# Altium project CPU_board.PrjPCB
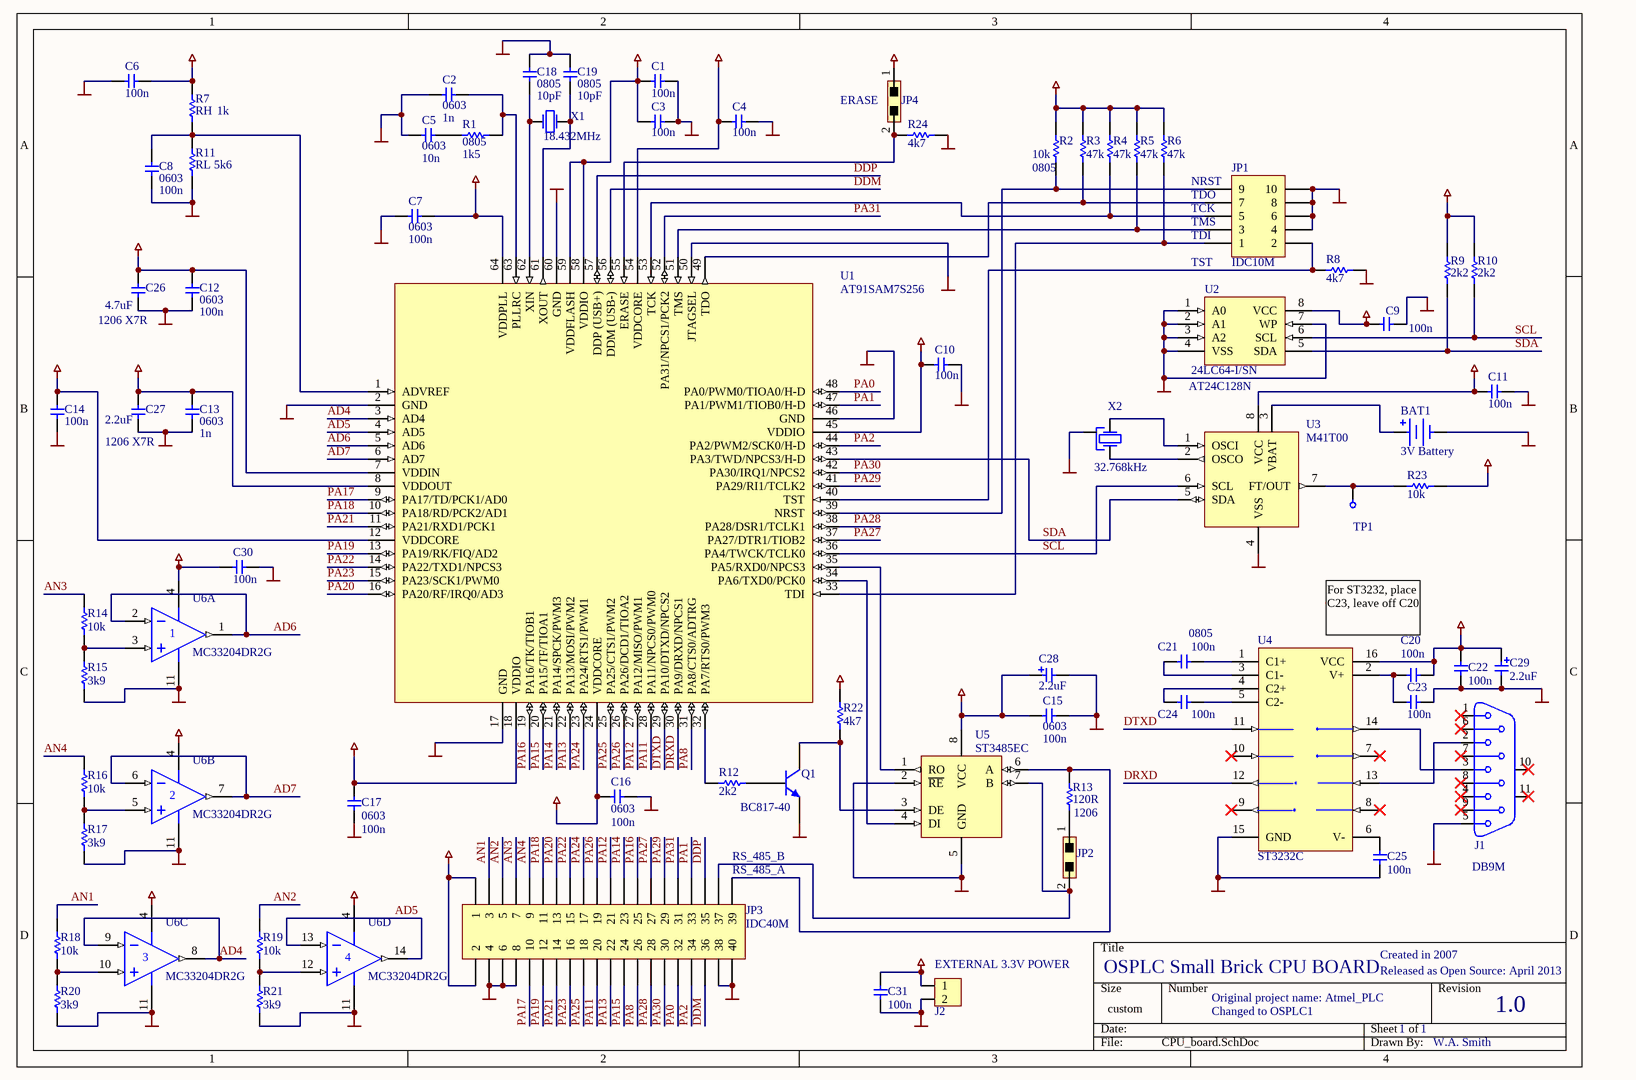
[diagram p0: CPU_board.SchDoc]
1 sheet, 72 parts. Net scope: global (net labels, ports and power ports of the same name join across sheets).
Board file: CPU_Board.PcbDoc

## Sheet CPU_board.SchDoc
size 294 x 198 mm

### Parts
BAT1  3V Battery  [BATTERY_22MM]
C1  value 100n  [0603]  (hidden comment: 0603)
C2  0603  value 1n  [0603]
C3  value 100n  [0603]  (hidden comment: 0603)
C4  value 100n  [0603]  (hidden comment: 0603)
C5  0603  value 10n  [0603]
C6  value 100n  [0603]  (hidden comment: 0603)
C7  0603  value 100n  [0603]
C8  0603  value 100n  [0603]
C9  value 100n  [0603]  (hidden comment: 0603)
C10  value 100n  [0603]  (hidden comment: 0603)
C11  value 100n  [0603]  (hidden comment: 0603)
C12  0603  value 100n  [0603]
C13  0603  value 1n  [0603]
C14  value 100n  [0603]  (hidden comment: 0603)
C15  0603  value 100n  [0603]
C16  0603  value 100n  [0603]
C17  0603  value 100n  [0603]
C18  0805  value 10pF  [0805]
C19  0805  value 10pF  [0805]
C20  value 100n  [0805]  (hidden comment: 0805)
C21  0805  value 100n  [0805]
C22  value 100n  [0805]  (hidden comment: 0805)
C23  value 100n  [0805]  (hidden comment: 0805)
C24  value 100n  [0805]  (hidden comment: 0805)
C25  value 100n  [0805]  (hidden comment: 0805)
C26  1206 X7R  value 4.7uF  [1206]
C27  1206 X7R  value 2.2uF  [1206]
C28  value 2.2uF  [CAP_TANT_A]  (hidden comment: Tant_A)
C29  value 2.2uF  [CAP_TANT_A]  (hidden comment: Tant_A)
C30  value 100n  [0603]  (hidden comment: 0603)
C31  value 100n  [0805]  (hidden comment: 0805)
J1  DB9M  [DB9M]
J2  Mini Screw Terminal  [MINI_TERMINAL_2]  (value not drawn)
JP1  IDC10M  [IDC_10M_BOX]
JP2  JUMPER2  [JUMPER2_254]  (value not drawn)
JP3  IDC40M  [IDC_40M_BOX]
JP4  JUMPER2  [JUMPER2_254]  (value not drawn)
Q1  BC817-40  [SO-G3/Y1]
R1  0805  value 1k5  [0805]
R2  0805  value 10k  [0805]
R3  value 47k  [0805]  (hidden comment: 0805)
R4  value 47k  [0805]  (hidden comment: 0805)
R5  value 47k  [0805]  (hidden comment: 0805)
R6  value 47k  [0805]  (hidden comment: 0805)
R7  value RH  [0805]  (hidden comment: 0805)
R8  value 4k7  [0805]  (hidden comment: 0805)
R9  value 2k2  [0805]  (hidden comment: 0805)
R10  value 2k2  [0805]  (hidden comment: 0805)
R11  value RL  [0805]  (hidden comment: 0805)
R12  value 2k2  [0805]  (hidden comment: 0805)
R13  1206  value 120R  [1206]
R14  value 10k  [0805]  (hidden comment: 0805)
R15  value 3k9  [0805]  (hidden comment: 0805)
R16  value 10k  [0805]  (hidden comment: 0805)
R17  value 3k9  [0805]  (hidden comment: 0805)
R18  value 10k  [0805]  (hidden comment: 0805)
R19  value 10k  [0805]  (hidden comment: 0805)
R20  value 3k9  [0805]  (hidden comment: 0805)
R21  value 3k9  [0805]  (hidden comment: 0805)
R22  value 4k7  [0805]  (hidden comment: 0805)
R23  value 10k  [0805]  (hidden comment: 0805)
R24  value 4k7  [0805]  (hidden comment: 0805)
TP1  TEST POINT  [TEST_POINT]  (value not drawn)
U1  AT91SAM7S256  [LQFP64-10-05]
U2  24LC64-I/SN  value AT24C128N  [SO-G8/Z7.4]
U3  M41T00  [SO-G8/X.6]
U4  ST3232C  [SO-G16/G6.9]
U5  ST3485EC  [SO-G8/Z7.4]
U6  MC33204DR2G  [SO-G14/Y2.2]  (parts A,B,C,D of 4)
X1  18.432MHz  [CRYSTAL_SMT]
X2  32.768kHz  [XTAL_TF]

### Nets
GND: BAT1.2(NEG) C1.2 C2.1 C3.2 C4.2 C5.1 C6.1 C7.1 C8.1 C9.2 C10.1 C11.2 C12.1 C13.1 C14.1 C15.2 C16.2 C17.1 C18.2 C19.2 C22.2 C23.1 C25.1 C26.1 C27.1 C28.2 C29.2 C30.2 C31.1 J1.5 J2.2 JP1.4 JP1.6 JP1.8 JP1.10 JP3.4 JP3.6 JP3.8 JP3.38 JP3.40 Q1.2(E) R8.1 R11.1 R15.1 R17.1 R20.1 R21.1 R24.2 U1.2(GND) U1.17(GND) U1.46(GND) U1.50(JTAGSEL) U1.60(GND) U2.1(A0) U2.2(A1) U2.3(A2) U2.4(VSS) U2.7(WP) U3.4(VSS) U4.15(GND) U5.2(~{RE}) U5.5(GND) U6.11(V-) X2.3(X)
VCC1v8: C4.1 C7.2 C13.2 C14.2 C16.1 C27.2 U1.8(VDDOUT) U1.12(VDDCORE) U1.24(VDDCORE) U1.54(VDDCORE) U1.64(VDDPLL)
VCC3v3: C1.1 C3.1 C6.2 C9.1 C10.2 C11.1 C12.2 C15.1 C17.2 C20.1 C22.1 C26.2 C28.1 C29.1 C30.1 C31.2 J2.1 JP3.1 JP3.2 JP4.1 R2.2 R3.2 R4.2 R5.2 R6.2 R7.2 R9.2 R10.2 R22.2 R23.2 U1.7(VDDIN) U1.18(VDDIO) U1.45(VDDIO) U1.58(VDDIO) U1.59(VDDFLASH) U2.8(VCC) U3.8(VCC) U4.16(VCC) U5.8(VCC) U6.4(V+)
AD4: U1.3(AD4) U6.8(OUT) U6.9(IN-)
AD5: U1.4(AD5) U6.13(IN-) U6.14(OUT)
AD6: U1.5(AD6) U6.1(OUT) U6.2(IN-)
AD7: U1.6(AD7) U6.6(IN-) U6.7(OUT)
AN1: JP3.3 R18.2
AN2: JP3.5 R19.2
AN3: JP3.7 R14.2
AN4: JP3.9 R16.2
DDM: JP3.36 U1.56(DDM_(USB-))
DDP: JP3.35 U1.57(DDP_(USB+))
DRXD: U1.30(PA9/DRXD/NPCS1) U4.12(R1OUT)
DTXD: U1.29(PA10/DTXD/NPCS2) U4.11(T1IN)
PA0: JP3.32 U1.48(PA0/PWM0/TIOA0/H-D)
PA1: JP3.33 U1.47(PA1/PWM1/TIOB0/H-D)
PA2: JP3.34 U1.44(PA2/PWM2/SCK0/H-D)
PA8: JP3.26 U1.31(PA8/CTS0/ADTRG)
PA11: JP3.20 U1.28(PA11/NPCS0/PWM0)
PA12: JP3.21 U1.27(PA12/MISO/PWM1)
PA13: JP3.22 U1.22(PA13/MOSI/PWM2)
PA14: JP3.23 U1.21(PA14/SPCK/PWM3)
PA15: JP3.24 U1.20(PA15/TF/TIOA1)
PA16: JP3.25 U1.19(PA16/TK/TIOB1)
PA17: JP3.10 U1.9(PA17/TD/PCK1/AD0)
PA18: JP3.11 U1.10(PA18/RD/PCK2/AD1)
PA19: JP3.12 U1.13(PA19/RK/FIQ/AD2)
PA20: JP3.13 U1.16(PA20/RF/IRQ0/AD3)
PA21: JP3.14 U1.11(PA21/RXD1/PCK1)
PA22: JP3.15 U1.14(PA22/TXD1/NPCS3)
PA23: JP3.16 U1.15(PA23/SCK1/PWM0)
PA24: JP3.17 U1.23(PA24/RTS1/PWM1)
PA25: JP3.18 U1.25(PA25/CTS1/PWM2)
PA26: JP3.19 U1.26(PA26/DCD1/TIOA2)
PA27: JP3.27 U1.37(PA27/DTR1/TIOB2)
PA28: JP3.28 U1.38(PA28/DSR1/TCLK1)
PA29: JP3.29 U1.41(PA29/RI1/TCLK2)
PA30: JP3.30 U1.42(PA30/IRQ1/NPCS2)
PA31: JP3.31 U1.52(PA31/NPCS1/PCK2)
SCL: R10.1 U1.36(PA4/TWCK/TCLK0) U2.6(SCL) U3.6(SCL)
SDA: R9.1 U1.43(PA3/TWD/NPCS3/H-D) U2.5(SDA) U3.5(SDA)
NetBAT1_1: BAT1.1(POS) U3.3(VBAT)
NetC2_2: C2.2 R1.2 U1.63(PLLRC)
NetC5_2: C5.2 R1.1
NetC8_2: C8.2 R7.1 R11.2 U1.1(ADVREF)
NetC18_1: C18.1 U1.62(XIN) X1.1(X)
NetC19_1: C19.1 U1.61(XOUT) X1.2(X)
NetC20_2: C20.2 C23.2 U4.2(V+)
NetC21_1: C21.1 U4.1(C1+)
NetC21_2: C21.2 U4.3(C1-)
NetC24_1: C24.1 U4.5(C2-)
NetC24_2: C24.2 U4.4(C2+)
NetC25_2: C25.2 U4.6(V-)
NetJ1_2: J1.2 U4.13(R1IN)
NetJ1_3: J1.3 U4.14(T1OUT)
NetJP1_1: JP1.1 R6.1 U1.33(TDI)
NetJP1_2: JP1.2 R8.2 U1.40(TST)
NetJP1_3: JP1.3 R5.1 U1.51(TMS)
NetJP1_5: JP1.5 R4.1 U1.53(TCK)
NetJP1_7: JP1.7 R3.1 U1.49(TDO)
NetJP1_9: JP1.9 R2.1 U1.39(NRST)
NetJP2_1: JP2.1 R13.1
NetJP2_2: JP2.2 JP3.37 U5.7(B)
NetJP3_39: JP3.39 R13.2 U5.6(A)
NetJP4_2: JP4.2 R24.1 U1.55(ERASE)
NetQ1_1: Q1.1(B) R12.1
NetQ1_3: Q1.3(C) R22.1 U5.3(DE)
NetR12_2: R12.2 U1.32(PA7/RTS0/PWM3)
NetR14_1: R14.1 R15.2 U6.3(IN+)
NetR16_1: R16.1 R17.2 U6.5(IN+)
NetR18_1: R18.1 R20.2 U6.10(IN+)
NetR19_1: R19.1 R21.2 U6.12(IN+)
NetR23_1: R23.1 TP1.1 U3.7(FT/OUT)
NetU1_34: U1.34(PA6/TXD0/PCK0) U5.4(DI)
NetU1_35: U1.35(PA5/RXD0/NPCS3) U5.1(RO)
NetU3_1: U3.1(OSCI) X2.1(X)
NetU3_2: U3.2(OSCO) X2.2(X)

Not connected (* = marked no-connect by the designer): J1 1* 4* 6* 7* 8* 9* 10* 11*; U4 7(T2OUT)* 8(R2IN)* 9(R2OUT)* 10(T2IN)*

### Notes on the sheet
- 1k
- (near JP4) ERASE
- (near R11) 5k6
- (near JP1) NRST
- (near JP1) TDO
- (near JP1) TCK
- (near JP1) TMS
- (near JP1) TDI
- TST
- For ST3232, place C23, leave off C20
- (near JP3) RS_485_A
- RS_485_B
- Created in 2007
- (near J2) EXTERNAL 3.3V POWER
- OSPLC Small Brick CPU BOARD
- Original project name: Atmel_PLC
- Changed to OSPLC1
- Released as Open Source: April 2013
- 1.0
- 1
- W.A. Smith

### Library data of the parts
BAT1 = BATTERY_22MM: 3 Volt Lithium Button Battery
C1-C17 C30 = CAP_0603: 0603 footprint non-polorised capacitor
C18-C25 C31 = CAP_0805: 0805 footprint non-polarised capacitor
C26 C27 = CAP_1206: 1206 footprint non-polorised capacitor
C28 C29 = CAP_TANT_A: Tantalum Capacitor, A Package
J1 = DB9M: DB 9 Male connector
J2 = MINI_TERMINAL_2: Mini Screw Terminal, 2.54mm Pitch
JP1 = IDC_10M: 10 pin IDC male connector, vertical, box
JP2 JP4 = JUMPER2: 2 Pin Jumper, 2.54mm
JP3 = IDC_40M: 40 pin IDC male connector, vertical, box
Q1 = BC817-40: NPN General Purpose Amplifier; Manufacturer: Fairchild Semiconductor; Revision 1: 11-July-2000: SIM Model Added.; Revision 2: July-2002: Re-released for DXP Platform.; Package Information: Latest Revision: Sep-1998; Class I: Discrete; Class II: BJT - Low Power; Published: 8-Jun-2000; Datasheet: Latest Revision: 1997; Package Reference: SOT-23A; Publisher: Altium Limited; Value: BC817-40
R1-R12 R14-R24 = RES_0805: 0805 footprint resistor
R13 = RES_1206: 1206 footprint resistor
TP1 = TEST_POINT
U1 = AT91SAM7S256: Atmel ARM7 microcontroller, 256k Flash; Value: AT91SAM7S256
U2 = 24LC64-I/SN: Microchip 64k bit I2C bus serial EEPROM
U3 = M41T00: ST Serial Access Timekeeper; Value: M41T00
U4 = MAX3232CWE: 3.0V TO 5.5V, Low-Power, up to 1Mbps, True RS-232 Transceiver Using Four 0.1µF External Capacitor; Manufacturer: Maxim; Class I: Communication; Published: 16-Jan-2001; Revision: July-2002: Re-released for DXP Platform.; Datasheet: Latest Revision: Mar-1999; Package Reference: WSO16; Publisher: Altium Limited; Class II: Transceiver; Value: ST3232C
U5 = ST3485EC: ST 3.3v RS-485/RS-422 Transceiver; Value: ST3485EC
U6 = LM2902D: Quad Low-Power Operational Amplifier; Manufacturer: Motorola; Package Information: Latest Revision: 1991; Published: 15-Apr-2002; Datasheet: Linear and Interface Integrated Circuits, DL128 Rev2 (1988); Package Reference: 751A-02; Publisher: Altium Limited; Class I: Amplifier; Class II: Operational Amplifier; Value: MC33204DR2G
X1 = CRYSTAL_SMT: SMT crystal; Value: 18.432MHz
X2 = CRYSTAL_TF: Tuning Fork Crystal; Value: 32.768kHz